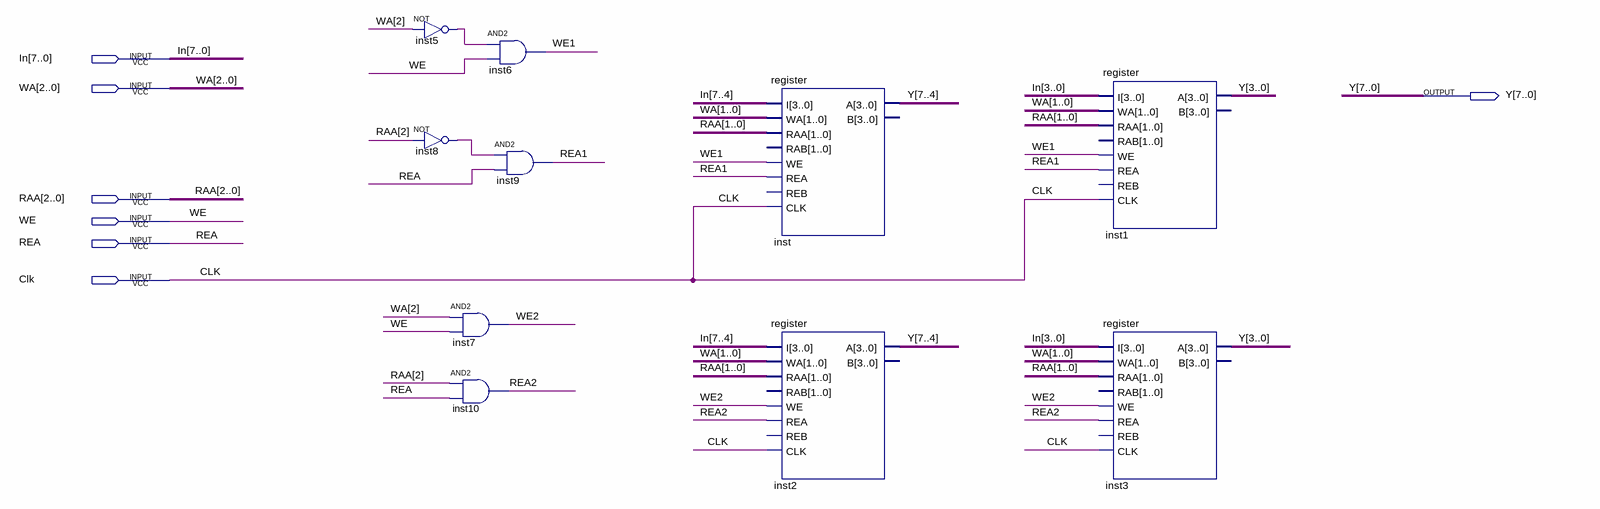
[diagram p0: schematic sheet]
// Quartus schematic Register8x8.bdf as structural Verilog: 10 symbols, 7 pins
module Register8x8 (
  input  [7:0] In,
  input  [2:0] WA,
  input  [2:0] RAA,
  input  WE,
  input  REA,
  input  Clk,
  output [7:0] Y
);

  wire inst5_out, inst8_out, REA1, REA2, WE1, WE2;

  not inst5 (inst5_out, WA[2]);
  not inst8 (inst8_out, RAA[2]);
  and inst7 (WE2, WA[2], WE);
  and inst10 (REA2, RAA[2], REA);
  and inst6 (WE1, inst5_out, WE);
  and inst9 (REA1, inst8_out, REA);
  register inst (
    .I(In[7:4]), .WA(WA[1:0]), .RAA(RAA[1:0]), .WE(WE1), .REA(REA1), .CLK(Clk), .A(Y[7:4]));  // open: RAB, REB, B
  register inst2 (
    .I(In[7:4]), .WA(WA[1:0]), .RAA(RAA[1:0]), .WE(WE2), .REA(REA2), .CLK(Clk), .A(Y[7:4]));  // open: RAB, REB, B
  register inst1 (
    .I(In[3:0]), .WA(WA[1:0]), .RAA(RAA[1:0]), .WE(WE1), .REA(REA1), .CLK(Clk), .A(Y[3:0]));  // open: RAB, REB, B
  register inst3 (
    .I(In[3:0]), .WA(WA[1:0]), .RAA(RAA[1:0]), .WE(WE2), .REA(REA2), .CLK(Clk), .A(Y[3:0]));  // open: RAB, REB, B
endmodule
